# EAGLE design hd6303-mb-ram-rom-x1.3 (EAGLE 9.2.2)

## Sheet 1 of 2
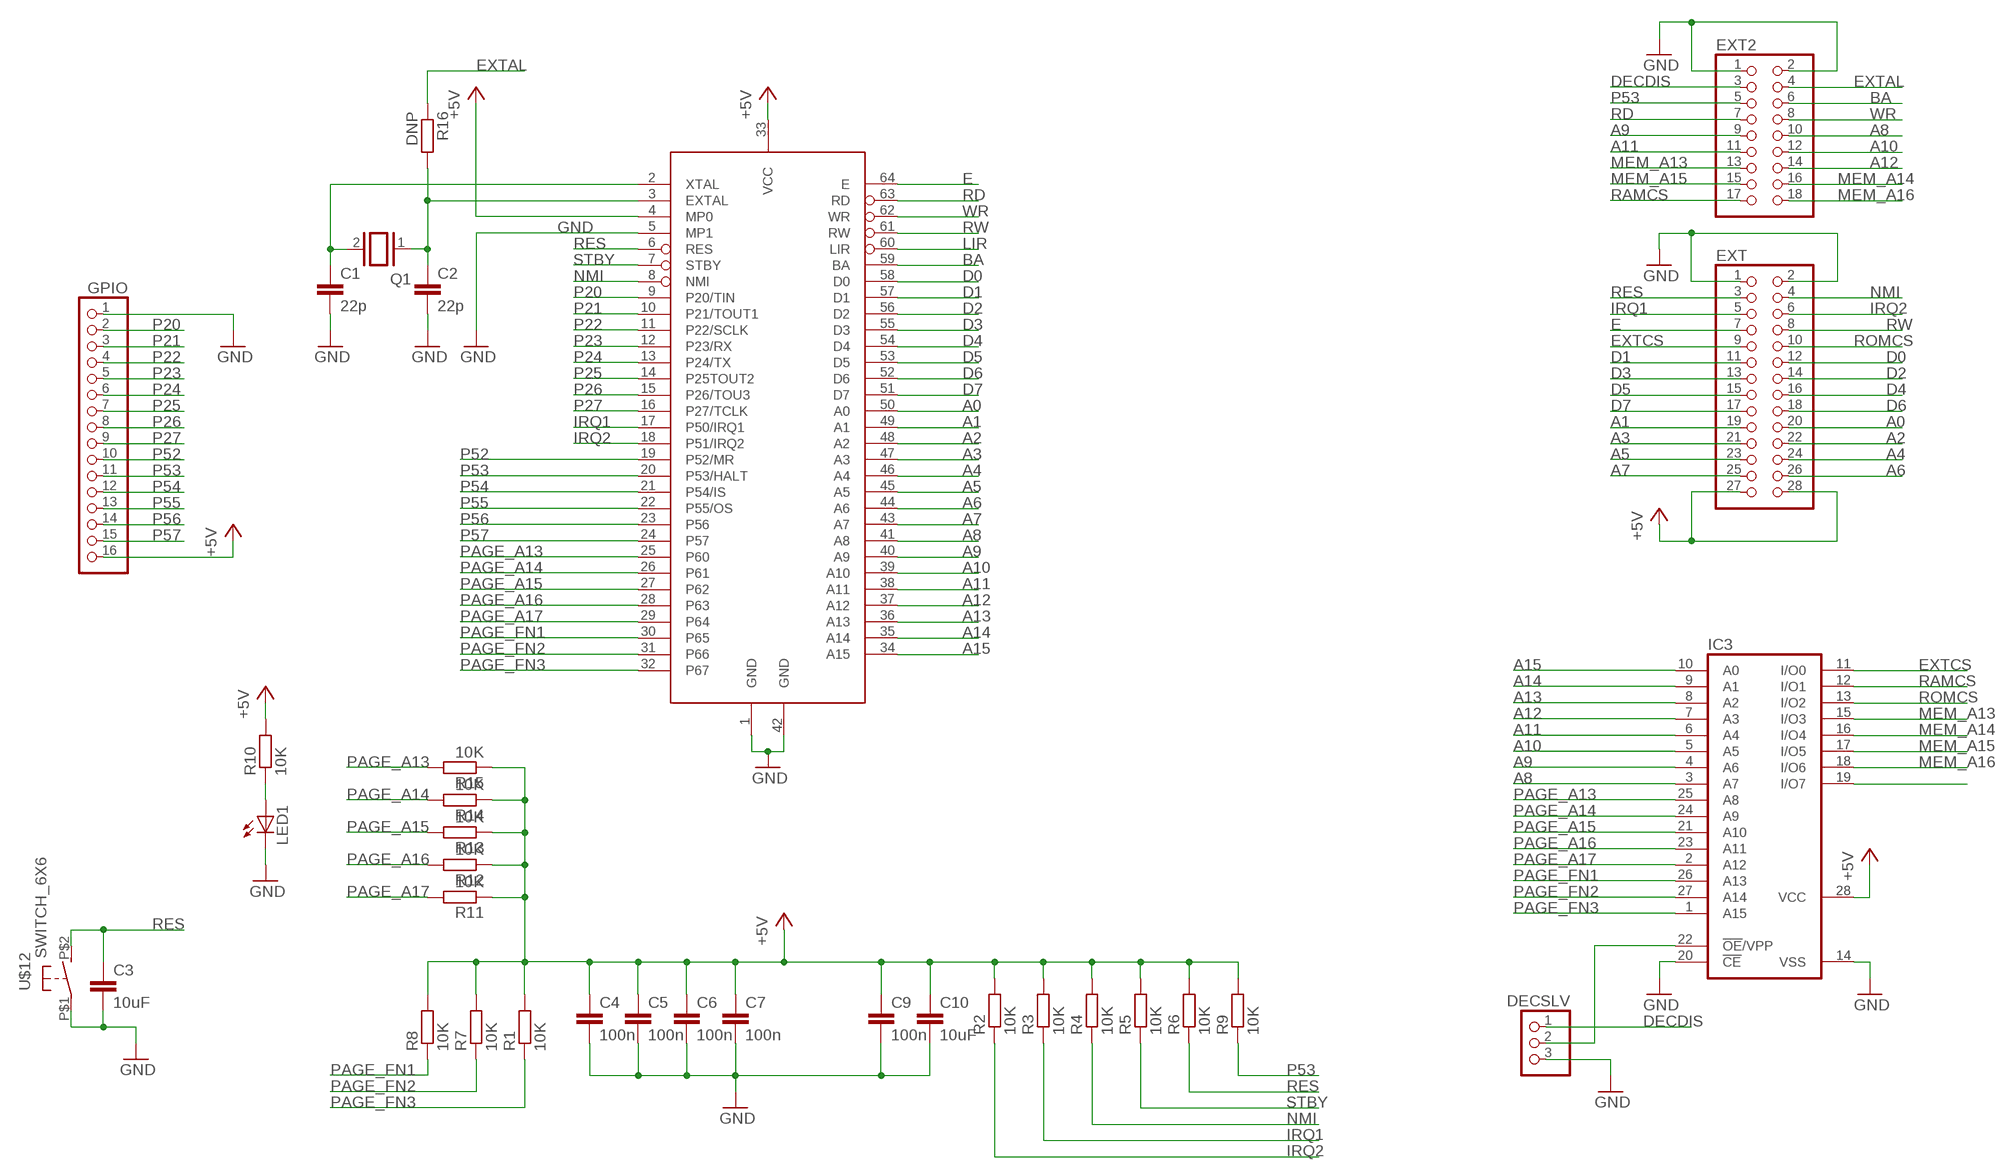
[diagram p0: schematic, sheet 1]

### Parts
C1  22p  C-EUC0603  [C0603]
C2  22p  C-EUC0603  [C0603]
C3  10uF  C-EUC0805  [C0805]
C4  100n  C-EUC0603  [C0603]
C5  100n  C-EUC0603  [C0603]
C6  100n  C-EUC0603  [C0603]
C7  100n  C-EUC0603  [C0603]
C9  100n  C-EUC0603  [C0603]
C10  10uF  C-EUC0805  [C0805]
DECSLV  PINHD-1X3  [1X03]
EXT  PINHD-2X14  [2X14]
EXT2  PINHD-2X9  [2X09]
GPIO  PINHD-1X16  [1X16]
IC3  27512G  [DIL28-6]
LED1  LED5MM  [LED5MM]
Q1  XTAL/S  [QS]
R1  10K  R-EU_R0603  [R0603]
R2  10K  R-EU_R0603  [R0603]
R3  10K  R-EU_R0603  [R0603]
R4  10K  R-EU_R0603  [R0603]
R5  10K  R-EU_R0603  [R0603]
R6  10K  R-EU_R0603  [R0603]
R7  10K  R-EU_R0603  [R0603]
R8  10K  R-EU_R0603  [R0603]
R9  10K  R-EU_R0603  [R0603]
R10  10K  R-EU_R0603  [R0603]
R11  10K  R-EU_R0603  [R0603]
R12  10K  R-EU_R0603  [R0603]
R13  10K  R-EU_R0603  [R0603]
R14  10K  R-EU_R0603  [R0603]
R15  10K  R-EU_R0603  [R0603]
R16  DNP  R-EU_R0603  [R0603]
U$1  HD6303YCP  [DP-64S]
U$12  SWITCH_6X6  [SWITCH_6X6]

### Nets
+5V [power]: C4.1 C5.1 C6.1 C7.1 C9.1 C10.1 EXT.27 EXT.28 GPIO.16 IC3.28(VCC) R1.2 R2.2 R3.2 R4.2 R5.2 R6.2 R7.2 R8.2 R9.2 R10.2 R11.1 R12.1 R13.1 R14.1 R15.1 U$1.4(MP0) U$1.33(VCC) ; also sheet 2
A0: EXT.20 U$1.50(A0) ; also sheet 2
A1: EXT.19 U$1.49(A1) ; also sheet 2
A2: EXT.22 U$1.48(A2) ; also sheet 2
A3: EXT.21 U$1.47(A3) ; also sheet 2
A4: EXT.24 U$1.46(A4) ; also sheet 2
A5: EXT.23 U$1.45(A5) ; also sheet 2
A6: EXT.26 U$1.44(A6) ; also sheet 2
A7: EXT.25 U$1.43(A7) ; also sheet 2
A8: EXT2.10 IC3.3(A7) U$1.41(A8) ; also sheet 2
A9: EXT2.9 IC3.4(A6) U$1.40(A9) ; also sheet 2
A10: EXT2.12 IC3.5(A5) U$1.39(A10) ; also sheet 2
A11: EXT2.11 IC3.6(A4) U$1.38(A11) ; also sheet 2
A12: EXT2.14 IC3.7(A3) U$1.37(A12) ; also sheet 2
A13: IC3.8(A2) U$1.36(A13)
A14: IC3.9(A1) U$1.35(A14)
A15: IC3.10(A0) U$1.34(A15)
BA: EXT2.6 U$1.59(BA)
D0: EXT.12 U$1.58(D0) ; also sheet 2
D1: EXT.11 U$1.57(D1) ; also sheet 2
D2: EXT.14 U$1.56(D2) ; also sheet 2
D3: EXT.13 U$1.55(D3) ; also sheet 2
D4: EXT.16 U$1.54(D4) ; also sheet 2
D5: EXT.15 U$1.53(D5) ; also sheet 2
D6: EXT.18 U$1.52(D6) ; also sheet 2
D7: EXT.17 U$1.51(D7) ; also sheet 2
DECDIS: DECSLV.1 EXT2.3
E: EXT.7 U$1.64(E)
EXTAL: EXT2.4 R16.1
EXTCS: EXT.9 IC3.11(I/O0)
GND [power]: C1.2 C2.2 C3.2 C4.2 C5.2 C6.2 C7.2 C9.2 C10.2 DECSLV.3 EXT2.1 EXT2.2 EXT.1 EXT.2 GPIO.1 IC3.14(VSS) IC3.20(!CE) LED1.K(C) U$1.1(GND) U$1.5(MP1) U$1.42(GND) U$12.P$1(P) ; also sheet 2
IRQ1: EXT.5 R3.1 U$1.17(P50/IRQ1)
IRQ2: EXT.6 R2.1 U$1.18(P51/IRQ2)
LIR: U$1.60(LIR)
MEM_A13: EXT2.13 IC3.15(I/O3) ; also sheet 2
MEM_A14: EXT2.16 IC3.16(I/O4) ; also sheet 2
MEM_A15: EXT2.15 IC3.17(I/O5) ; also sheet 2
MEM_A16: EXT2.18 IC3.18(I/O6) ; also sheet 2
N$1: LED1.A R10.1
N$2: DECSLV.2 IC3.22(!OE!/VPP)
N$5: C1.1 Q1.2 U$1.2(XTAL)
N$25: IC3.19(I/O7)
N$30: C2.1 Q1.1 R16.2 U$1.3(EXTAL)
NMI: EXT.4 R4.1 U$1.8(NMI)
P20: GPIO.2 U$1.9(P20/TIN)
P21: GPIO.3 U$1.10(P21/TOUT1)
P22: GPIO.4 U$1.11(P22/SCLK)
P23: GPIO.5 U$1.12(P23/RX)
P24: GPIO.6 U$1.13(P24/TX)
P25: GPIO.7 U$1.14(P25TOUT2)
P26: GPIO.8 U$1.15(P26/TOU3)
P27: GPIO.9 U$1.16(P27/TCLK)
P52: GPIO.10 U$1.19(P52/MR)
P53: EXT2.5 GPIO.11 R9.1 U$1.20(P53/HALT)
P54: GPIO.12 U$1.21(P54/IS)
P55: GPIO.13 U$1.22(P55/OS)
P56: GPIO.14 U$1.23(P56)
P57: GPIO.15 U$1.24(P57)
PAGE_A13: IC3.25(A8) R15.2 U$1.25(P60)
PAGE_A14: IC3.24(A9) R14.2 U$1.26(P61)
PAGE_A15: IC3.21(A10) R13.2 U$1.27(P62)
PAGE_A16: IC3.23(A11) R12.2 U$1.28(P63)
PAGE_A17: IC3.2(A12) R11.2 U$1.29(P64)
PAGE_FN1: IC3.26(A13) R8.1 U$1.30(P65)
PAGE_FN2: IC3.27(A14) R7.1 U$1.31(P66)
PAGE_FN3: IC3.1(A15) R1.1 U$1.32(P67)
RAMCS: EXT2.17 IC3.12(I/O1) ; also sheet 2
RD: EXT2.7 U$1.63(RD) ; also sheet 2
RES: C3.1 EXT.3 R6.1 U$1.6(RES) U$12.P$2(S)
ROMCS: EXT.10 IC3.13(I/O2) ; also sheet 2
RW: EXT.8 U$1.61(RW)
STBY: R5.1 U$1.7(STBY)
WR: EXT2.8 U$1.62(WR) ; also sheet 2

## Sheet 2 of 2
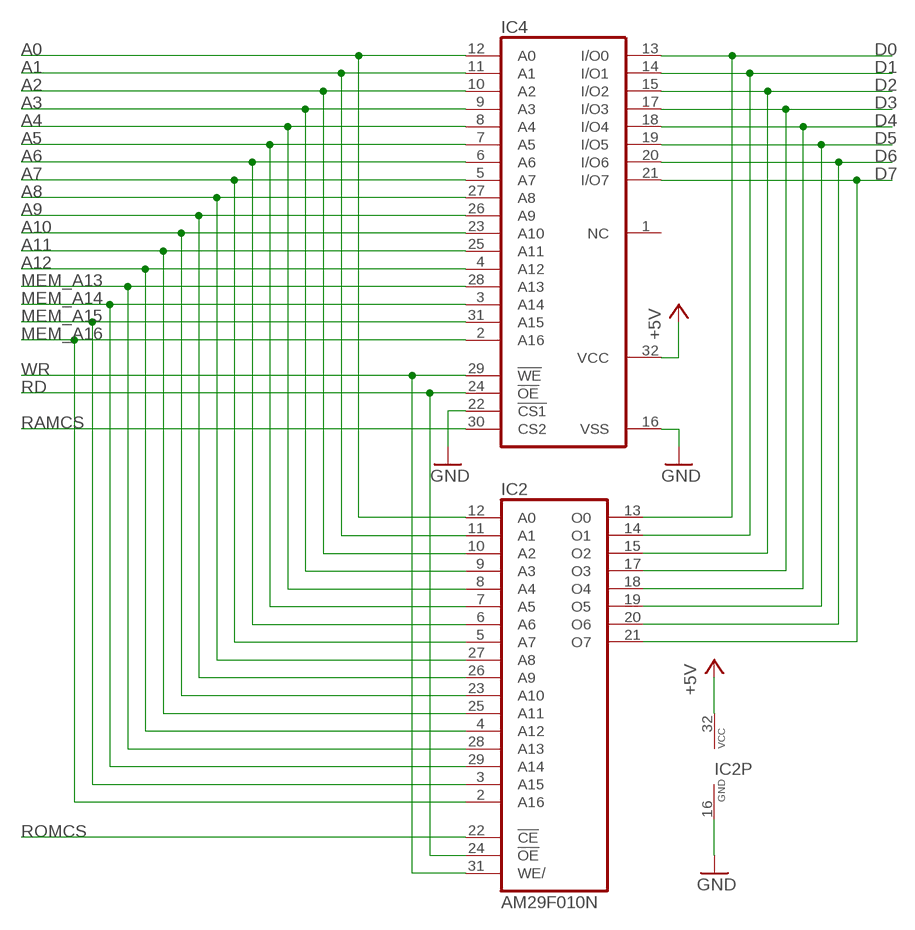
[diagram p1: schematic, sheet 2]

### Parts
IC2  AM29F010N  [DIP32]
IC4  628128P  [DIL32]

### Nets
+5V [power]: IC2.32(VCC) IC4.32(VCC) ; also sheet 1
A0: IC2.12(A0) IC4.12(A0) ; also sheet 1
A1: IC2.11(A1) IC4.11(A1) ; also sheet 1
A2: IC2.10(A2) IC4.10(A2) ; also sheet 1
A3: IC2.9(A3) IC4.9(A3) ; also sheet 1
A4: IC2.8(A4) IC4.8(A4) ; also sheet 1
A5: IC2.7(A5) IC4.7(A5) ; also sheet 1
A6: IC2.6(A6) IC4.6(A6) ; also sheet 1
A7: IC2.5(A7) IC4.5(A7) ; also sheet 1
A8: IC2.27(A8) IC4.27(A8) ; also sheet 1
A9: IC2.26(A9) IC4.26(A9) ; also sheet 1
A10: IC2.23(A10) IC4.23(A10) ; also sheet 1
A11: IC2.25(A11) IC4.25(A11) ; also sheet 1
A12: IC2.4(A12) IC4.4(A12) ; also sheet 1
D0: IC2.13(O0) IC4.13(I/O0) ; also sheet 1
D1: IC2.14(O1) IC4.14(I/O1) ; also sheet 1
D2: IC2.15(O2) IC4.15(I/O2) ; also sheet 1
D3: IC2.17(O3) IC4.17(I/O3) ; also sheet 1
D4: IC2.18(O4) IC4.18(I/O4) ; also sheet 1
D5: IC2.19(O5) IC4.19(I/O5) ; also sheet 1
D6: IC2.20(O6) IC4.20(I/O6) ; also sheet 1
D7: IC2.21(O7) IC4.21(I/O7) ; also sheet 1
GND [power]: IC2.16(GND) IC4.16(VSS) IC4.22(!CS1) ; also sheet 1
MEM_A13: IC2.28(A13) IC4.28(A13) ; also sheet 1
MEM_A14: IC2.29(A14) IC4.3(A14) ; also sheet 1
MEM_A15: IC2.3(A15) IC4.31(A15) ; also sheet 1
MEM_A16: IC2.2(A16) IC4.2(A16) ; also sheet 1
RAMCS: IC4.30(CS2) ; also sheet 1
RD: IC2.24(!OE) IC4.24(!OE) ; also sheet 1
ROMCS: IC2.22(!CE) ; also sheet 1
WR: IC2.31(WE/) IC4.29(!WE) ; also sheet 1
Unconnected: IC2.1(NC) IC2.30(NC) IC4.1(NC)

## Library data of the parts
C1 = rcl:C-EU: CAPACITOR, European symbol; SPICEPREFIX: C
C2 C4-C7 C9 = rcl:C-EU: CAPACITOR, European symbol
C3 C10 = resistor:C-EU: CAPACITOR, European symbol
DECSLV = pinhead:PINHD-1X3: PIN HEADER
EXT = pinhead:PINHD-2X14: PIN HEADER
EXT2 = pinhead:PINHD-2X9: PIN HEADER
GPIO = pinhead:PINHD-1X16: PIN HEADER
IC2 = am29-memory:AM29F010*: 1-Megabit FLASH MEMORY (128 K x 8 bit) 5 V-only
IC3 = memory-hitachi:27512G: MEMORY; OC_FARNELL: unknown; OC_NEWARK: unknown
IC4 = memory-hitachi:628128P: MEMORY; OC_FARNELL: unknown; OC_NEWARK: unknown
LED1 = led:LED: LED OSRAM: - CHIPLED LG R971, LG N971, LY N971, LG Q971, LY Q971, LO R971, LY R971 LH N974, LH R974 LS Q976, LO Q976, LY Q976 LO Q996 - Hyper CHIPLED LW Q18S LB Q993, LB Q99A, LB R99A - SideLED LS A670, LO A670, LY A670, LG A670, LP A670 LB A673, LV A673, LT A673, LW A673 LH A674 LY A675 LS A676, LA A676, LO A676, LY A676, LW A676 LS A679, LY A679, LG A679 - Hyper Micro SIDELED® LS Y876, LA Y876, LO Y876, LY Y876 LT Y87S - SmartLED LW L88C, LW L88S LB L89C, LB L89S, LG L890 LS L89K, LO L89K, LY L89K LS L896, LA L896, LO L896, LY L896 - TOPLED LS T670, LO T670, LY T670, LG T670, LP T670 LSG T670, LSP T670, LSY T670, LOP T670, LYG T670 LG T671, LOG T671, LSG T671 LB T673, LV T673, LT T673, LW T673 LH T674 LS T676, LA T676, LO T676, LY T676, LB T676, LH T676, LSB T676, LW T676 LB T67C, LV T67C, LT T67C, LS T67K, LO T67K, LY T67K, LW E67C LS E67B, LA E67B, LO E67B, LY E67B, LB E67C, LV E67C, LT E67C LW T67C LS T679, LY T679, LG T679 LS T770, LO T770, LY T770, LG T770, LP T770 LB T773, LV T773, LT T773, LW T773 LH T774 LS E675, LA E675, LY E675, LS T675 LS T776, LA T776, LO T776, LY T776, LB T776 LHGB T686 LT T68C, LB T68C - Hyper Mini TOPLED® LB M676 - Mini TOPLED Santana® LG M470 LS M47K, LO M47K, LY M47K Source: http://www.osram.convergy.de LUXEON: - LUMILED® LXK2-PW12-R00, LXK2-PW12-S00, LXK2-PW14-U00, LXK2-PW14-V00 LXK2-PM12-R00, LXK2-PM12-S00, LXK2-PM14-U00 LXK2-PE12-Q00, LXK2-PE12-R00, LXK2-PE12-S00, LXK2-PE14-T00, LXK2-PE14-U00 LXK2-PB12-K00, LXK2-PB12-L00, LXK2-PB12-M00, LXK2-PB14-N00, LXK2-PB14-P00, LXK2-PB14-Q00 LXK2-PR12-L00, LXK2-PR12-M00, LXK2-PR14-Q00, LXK2-PR14-R00 LXK2-PD12-Q00, LXK2-PD12-R00, LXK2-PD12-S00 LXK2-PH12-R00, LXK2-PH12-S00 LXK2-PL12-P00, LXK2-PL12-Q00, LXK2-PL12-R00 Source: www.luxeon.com KINGBRIGHT: KA-3528ASYC Source: www.kingbright.com
Q1 = special:XTAL/S: CRYSTAL
R1-R16 = resistor:R-EU_: RESISTOR, European symbol
U$1 = addons-lib:HD6303YCP
U$12 = mouse_enc:SWITCH_6X6

## Net classes
0 default: width 0.152 mm
1 power: width 0.813 mm

## Board
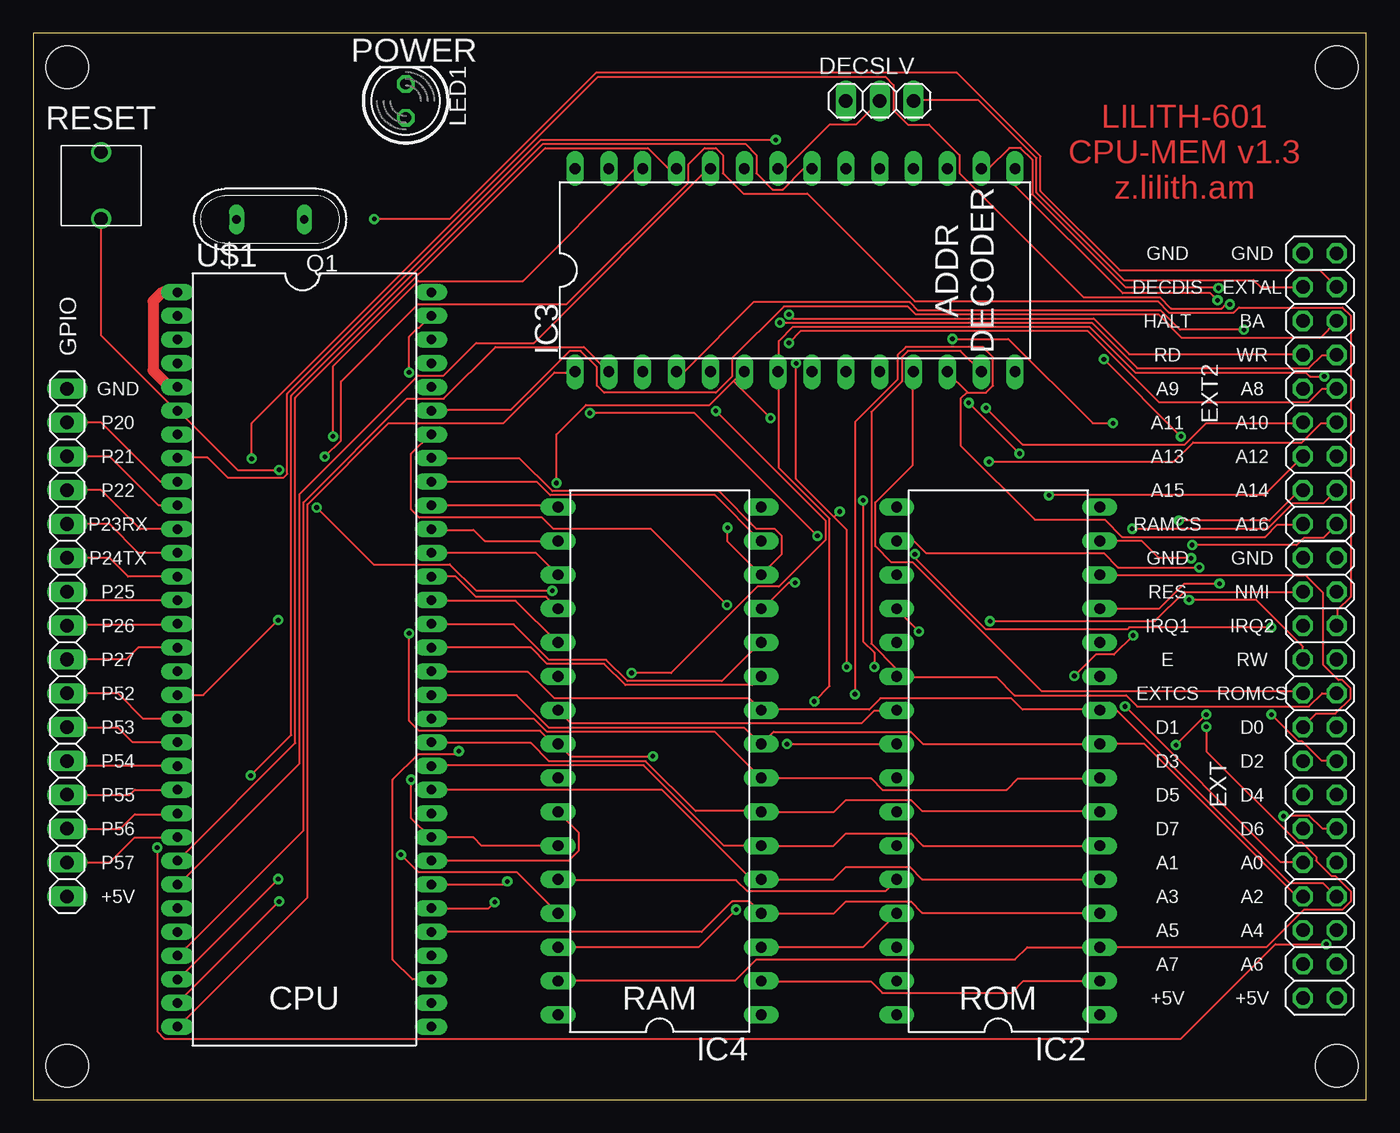
[diagram p2: board, top side]
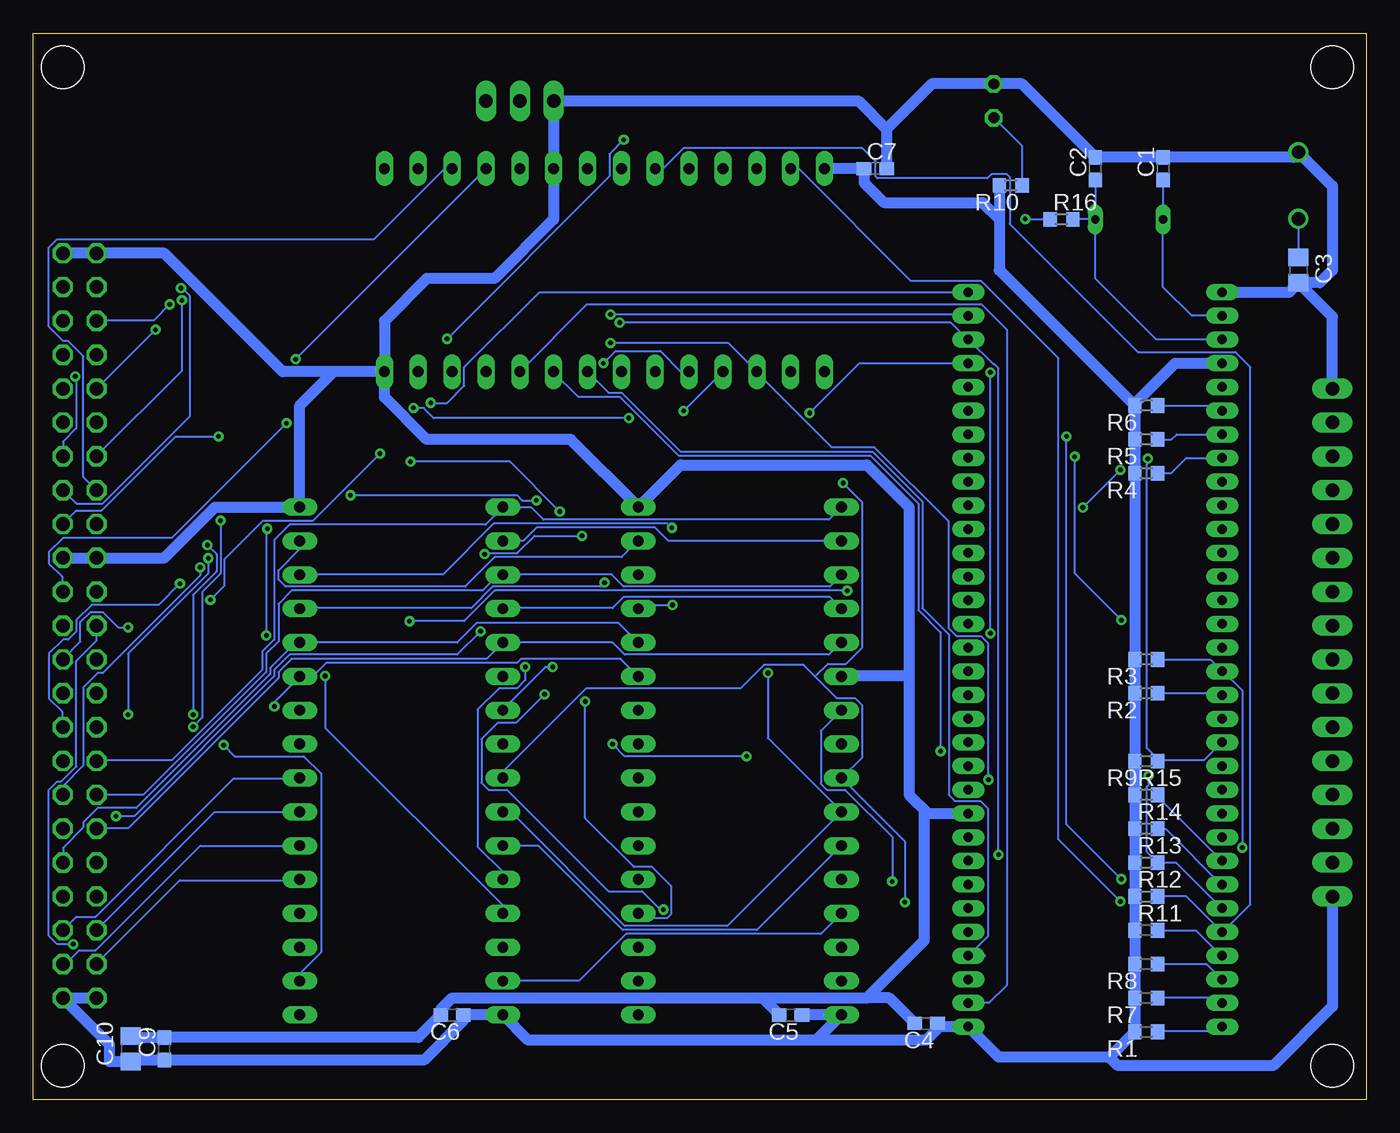
[diagram p3: board, bottom side, seen from below]

Size 100 x 80 mm. Coordinates in mm from the lower left corner, seen from the top.
Outline: 0,0 100,0 100,80 0,80 0,0
Copper layers (1*16): Top 0.035mm / dielectric 1.5mm / Bottom 0.035mm
Design rules "default *": minimum track width 6mil, minimum drill 0.35mm, track to track 6mil, track to pad 6mil, pad to pad 6mil, via to via 6mil, smd to smd 6mil, copper to edge 40mil, drill to drill 6mil, minimum pad ring 10mil, minimum via ring 8mil, stop-mask expansion 4mil, vias tented up to drill 23mil, thermal gap 10mil
Holes 3.2 mm at 2.54,77.47 2.54,2.54 97.79,2.54 97.79,77.47

### Footprints (pad centres in the part's own frame; a part is rotated, then mirrored left to right if it is on the bottom)
C0603 = smd 1.1 x 1: 1 -0.85,0; 2 0.85,0
C0805 = smd 1.3 x 1.5: 1 -0.95,0; 2 0.95,0
1X03 = drill 1.016 long: 1 -2.54,0; 2 0,0; 3 2.54,0
2X14 = drill 1.016 octagon: 1 -16.51,-1.27; 2 -16.51,1.27; 3 -13.97,-1.27; 4 -13.97,1.27; 5 -11.43,-1.27; 6 -11.43,1.27; 7 -8.89,-1.27; 8 -8.89,1.27; 9 -6.35,-1.27; 10 -6.35,1.27; 11 -3.81,-1.27; 12 -3.81,1.27; 13 -1.27,-1.27; 14 -1.27,1.27; 15 1.27,-1.27; 16 1.27,1.27; 17 3.81,-1.27; 18 3.81,1.27; 19 6.35,-1.27; 20 6.35,1.27; 21 8.89,-1.27; 22 8.89,1.27; 23 11.43,-1.27; 24 11.43,1.27; 25 13.97,-1.27; 26 13.97,1.27; 27 16.51,-1.27; 28 16.51,1.27
2X09 = drill 1.016 octagon: 1 -10.16,-1.27; 2 -10.16,1.27; 3 -7.62,-1.27; 4 -7.62,1.27; 5 -5.08,-1.27; 6 -5.08,1.27; 7 -2.54,-1.27; 8 -2.54,1.27; 9 0,-1.27; 10 0,1.27; 11 2.54,-1.27; 12 2.54,1.27; 13 5.08,-1.27; 14 5.08,1.27; 15 7.62,-1.27; 16 7.62,1.27; 17 10.16,-1.27; 18 10.16,1.27
1X16 = drill 1.016 long: 1 -19.05,0; 2 -16.51,0; 3 -13.97,0; 4 -11.43,0; 5 -8.89,0; 6 -6.35,0; 7 -3.81,0; 8 -1.27,0; 9 1.27,0; 10 3.81,0; 11 6.35,0; 12 8.89,0; 13 11.43,0; 14 13.97,0; 15 16.51,0; 16 19.05,0
DIP32 = drill 0.813 long: 1 -19.05,-7.62; 2 -16.51,-7.62; 3 -13.97,-7.62; 4 -11.43,-7.62; 5 -8.89,-7.62; 6 -6.35,-7.62; 7 -3.81,-7.62; 8 -1.27,-7.62; 9 1.27,-7.62; 10 3.81,-7.62; 11 6.35,-7.62; 12 8.89,-7.62; 13 11.43,-7.62; 14 13.97,-7.62; 15 16.51,-7.62; 16 19.05,-7.62; 17 19.05,7.62; 18 16.51,7.62; 19 13.97,7.62; 20 11.43,7.62; 21 8.89,7.62; 22 6.35,7.62; 23 3.81,7.62; 24 1.27,7.62; 25 -1.27,7.62; 26 -3.81,7.62; 27 -6.35,7.62; 28 -8.89,7.62; 29 -11.43,7.62; 30 -13.97,7.62; 31 -16.51,7.62; 32 -19.05,7.62
DIL28-6 = drill 0.813 long: 1 -16.51,-7.62; 2 -13.97,-7.62; 3 -11.43,-7.62; 4 -8.89,-7.62; 5 -6.35,-7.62; 6 -3.81,-7.62; 7 -1.27,-7.62; 8 1.27,-7.62; 9 3.81,-7.62; 10 6.35,-7.62; 11 8.89,-7.62; 12 11.43,-7.62; 13 13.97,-7.62; 14 16.51,-7.62; 15 16.51,7.62; 16 13.97,7.62; 17 11.43,7.62; 18 8.89,7.62; 19 6.35,7.62; 20 3.81,7.62; 21 1.27,7.62; 22 -1.27,7.62; 23 -3.81,7.62; 24 -6.35,7.62; 25 -8.89,7.62; 26 -11.43,7.62; 27 -13.97,7.62; 28 -16.51,7.62
DIL32 = drill 0.813 long: 1 -19.05,-7.62; 2 -16.51,-7.62; 3 -13.97,-7.62; 4 -11.43,-7.62; 5 -8.89,-7.62; 6 -6.35,-7.62; 7 -3.81,-7.62; 8 -1.27,-7.62; 9 1.27,-7.62; 10 3.81,-7.62; 11 6.35,-7.62; 12 8.89,-7.62; 13 11.43,-7.62; 14 13.97,-7.62; 15 16.51,-7.62; 16 19.05,-7.62; 17 19.05,7.62; 18 16.51,7.62; 19 13.97,7.62; 20 11.43,7.62; 21 8.89,7.62; 22 6.35,7.62; 23 3.81,7.62; 24 1.27,7.62; 25 -1.27,7.62; 26 -3.81,7.62; 27 -6.35,7.62; 28 -8.89,7.62; 29 -11.43,7.62; 30 -13.97,7.62; 31 -16.51,7.62; 32 -19.05,7.62
LED5MM = drill 0.813 octagon: A -1.27,0; K 1.27,0
QS = drill 0.61 long: 1 -2.54,0; 2 2.54,0
R0603 = smd 1 x 1.1: 1 -0.85,0; 2 0.85,0
DP-64S = drill 0.711 long: 1 -27.559,-9.525; 2 -25.781,-9.525; 3 -24.003,-9.525; 4 -22.225,-9.525; 5 -20.447,-9.525; 6 -18.669,-9.525; 7 -16.891,-9.525; 8 -15.113,-9.525; 9 -13.335,-9.525; 10 -11.557,-9.525; 11 -9.779,-9.525; 12 -8.001,-9.525; 13 -6.223,-9.525; 14 -4.445,-9.525; 15 -2.667,-9.525; 16 -0.889,-9.525; 17 0.889,-9.525; 18 2.667,-9.525; 19 4.445,-9.525; 20 6.223,-9.525; 21 8.001,-9.525; 22 9.779,-9.525; 23 11.557,-9.525; 24 13.335,-9.525; 25 15.113,-9.525; 26 16.891,-9.525; 27 18.669,-9.525; 28 20.447,-9.525; 29 22.225,-9.525; 30 24.003,-9.525; 31 25.781,-9.525; 32 27.559,-9.525; 33 27.559,9.525; 34 25.781,9.525; 35 24.003,9.525; 36 22.225,9.525; 37 20.447,9.525; 38 18.669,9.525; 39 16.891,9.525; 40 15.113,9.525; 41 13.335,9.525; 42 11.557,9.525; 43 9.779,9.525; 44 8.001,9.525; 45 6.223,9.525; 46 4.445,9.525; 47 2.667,9.525; 48 0.889,9.525; 49 -0.889,9.525; 50 -2.667,9.525; 51 -4.445,9.525; 52 -6.223,9.525; 53 -8.001,9.525; 54 -9.779,9.525; 55 -11.557,9.525; 56 -13.335,9.525; 57 -15.113,9.525; 58 -16.891,9.525; 59 -18.669,9.525; 60 -20.447,9.525; 61 -22.225,9.525; 62 -24.003,9.525; 63 -25.781,9.525; 64 -27.559,9.525
SWITCH_6X6 = drill 1: P$1 -2.5,0; P$2 2.5,0

### Placement (x,y rotation side)
C1  15.24,69.85 90 bottom
C2  20.32,69.85 90 bottom
C3  5.08,62.23 270 bottom
C4  33.02,5.71 180 bottom
C5  43.18,6.35 180 bottom
C6  68.58,6.35 180 bottom
C7  36.83,69.85 0 bottom
C9  90.17,3.81 90 bottom
C10  92.71,3.81 90 bottom
DECSLV  63.5,74.93 180 top
EXT  96.52,24.13 270 top
EXT2  96.52,53.34 270 top
GPIO  2.54,34.29 270 top
IC2  72.39,25.4 90 top
IC3  57.15,62.23 0 top
IC4  46.99,25.4 90 top
LED1  27.94,74.93 90 top
Q1  17.78,66.04 180 top
R1  16.51,5.08 180 bottom
R2  16.51,30.48 180 bottom
R3  16.51,33.02 180 bottom
R4  16.51,46.99 180 bottom
R5  16.51,49.53 180 bottom
R6  16.51,52.07 180 bottom
R7  16.51,7.62 180 bottom
R8  16.51,10.16 180 bottom
R9  16.51,25.4 180 bottom
R10  26.67,68.58 180 bottom
R11  16.51,12.7 0 bottom
R12  16.51,15.24 0 bottom
R13  16.51,17.78 0 bottom
R14  16.51,20.32 0 bottom
R15  16.51,22.86 0 bottom
R16  22.86,66.04 0 bottom
U$1  20.32,33.02 270 top
U$12  5.08,68.58 270 top

### Tracks (layer width: path | path; a pad name or v marks a point on that pad's centre or on a via)
+5V
  Bottom 0.813: IC3.28 C7.1 37.68,68.8 36.2,67.31 28.79,67.31 27.52,66.04 | R10.2 27.52,66.04 | 27.52,66.04 27.52,62.23 R6.2 | R6.2 R5.2 R4.2 R3.2 R2.2 R9.2 R15.1 R14.1 R13.1 R12.1 R11.1 R8.2 R7.2 R1.2 19.27,3.17 | C5.1 IC4.32 41.27,4.45 | 41.27,4.45 62.87,4.45 IC2.32 C6.1 67.73,5.93 70.7,2.96 C9.1 92.61,2.96 C10.1 94.3,2.86 94.3,4.13 EXT.28 EXT.27 | GPIO.16 2.54,6.99 6.99,2.54 18.63,2.54 19.27,3.17 | 19.27,3.17 27.56,3.17 U$1.33 31.92,5.46 C4.1 32.17,5.29 33.02,4.45 41.27,4.45 | U$1.4 14.33,55.24 17.14,52.43 R6.2
A0
  Top 0.152: U$1.50 29.87,35.66 36.04,35.66 38.71,32.99 42.98,32.99 44.58,31.39 51.66,31.39 54.56,34.29 IC4.12
  Bottom 0.152: IC4.12 54.63,34.29 56.08,35.74 66.75,35.74 68.2,34.29 IC2.12 80.31,34.29 82.22,32.38 82.22,31.93 92.28,21.87 95.17,21.87 96.24,20.8 96.24,20.42 97.77,18.9 97.77,17.83 EXT.20
A1  (via drill 0.35)
  Top 0.152: U$1.49 37.34,33.91 38.56,32.69 42.82,32.69 44.42,31.09 53.95,31.09 IC4.11 | v81.92,29.49 93.57,17.83 95.25,17.83 EXT.19
  Bottom 0.152: IC4.11 55.93,33.07 63.4,33.07 63.7,32.77 78.03,32.77 79.02,31.77 80.01,31.77 IC2.11 80.01,31.7 81.92,29.79 v81.92,29.49
A2
  Top 0.152: U$1.48 29.87,32.08 37.11,32.08 39.09,30.1 53.72,30.1 IC4.10 54.63,29.26 62.71,29.26 63.55,30.1 73.38,30.1 74.22,29.26 80.01,29.26 IC2.10 80.01,29.18 81.31,29.18 94.26,16.23 96.77,16.23 97.77,15.24 EXT.22
A3
  Top 0.152: EXT.21 94.79,15.24 83.36,26.67 IC2.9 66.75,26.67 65.84,27.58 55.55,27.58 54.63,26.67 IC4.9 54.56,26.67 53.34,27.89 38.71,27.89 36.27,30.33 29.87,30.33 U$1.47
A4
  Top 0.152: U$1.46 37.57,28.57 38.56,27.58 51.13,27.58 54.56,24.16 IC4.8 54.63,24.08 62.87,24.08 63.7,23.24 73.03,23.24 73.86,24.08 80.01,24.08 IC2.8
  Bottom 0.152: EXT.24 96.77,13.72 95.33,13.72 84.96,24.08 80.01,24.08 IC2.8
A5
  Top 0.152: U$1.45 29.87,26.75 37.34,26.75 38.71,25.38 45.95,25.38 49.68,21.64 54.56,21.64 IC4.7 60.07,21.59 60.96,22.48 65.84,22.48 66.67,21.64 80.01,21.64 IC2.7
  Bottom 0.152: IC2.7 80.01,21.57 86.41,21.57 95.25,12.72 EXT.23
A6
  Top 0.152: U$1.44 29.87,25.07 45.8,25.07 51.82,19.05 IC4.6 60.05,19.05 60.96,19.96 65.84,19.96 66.75,19.05 IC2.6
  Bottom 0.152: IC2.6 87.48,19.05 95.33,11.2 96.55,11.2 97.54,10.21 97.77,10.21 EXT.26
A7
  Top 0.152: U$1.43 47.17,23.24 53.87,16.54 54.56,16.54 IC4.5 60.02,16.51 60.96,17.45 65.76,17.45 66.67,16.54 80.01,16.54 IC2.5
  Bottom 0.152: IC2.5 80.01,16.46 89,16.46 95.25,10.21 EXT.25
A8  (via drill 0.35)
  Top 0.152: v28.35,24 28.35,21.11 29.79,19.66 U$1.41 29.87,19.66 33.02,19.66 33.63,19.05 IC4.27 | EXT2.10 96.7,53.34 95.71,52.35 84.43,52.35 79.1,57.68 57.61,57.68 v56.69,56.77
  Bottom 0.152: v28.35,24 28.35,34.21 28.88,34.75 30.71,34.75 31.32,35.36 31.32,43.36 36.88,48.92 40.08,48.92 45.72,54.56 IC3.3 45.72,54.63 47.85,56.77 v56.69,56.77 | IC2.27 62.1,19.05 55.78,12.72 45.72,12.72 39.4,19.05 IC4.27
A9  (via drill 0.35)
  Top 0.152: U$1.40 40.16,17.91 40.92,18.67 40.92,20.04 IC4.26 | v90.83,57.76 86.03,57.76 84.58,59.21 66.37,59.21 65.76,59.82 54.03,59.82 48.84,54.63 48.31,54.63 IC3.4 | v44.88,32 47.85,32 54.33,38.48 55.93,38.48 59.44,41.99 59.44,43.43 v51.21,51.66
  Bottom 0.152: IC2.26 64.77,21.57 64.16,21.57 55.63,13.03 47.93,13.03 IC4.26 39.4,21.64 44.88,27.13 v44.88,32 | EXT2.9 v90.83,57.76 | IC3.4 v51.21,51.66
A10  (via drill 0.35)
  Top 0.152: IC4.23 40.31,28.27 62.18,28.27 63.09,29.18 64.77,29.18 IC2.23 | v57.23,55.24 57.23,46.56 60.08,43.7 | 60.08,43.7 61.04,42.75 v61.04,32.46 | v71.7,47.85 85.57,47.85 87.02,49.3 95.17,49.3 96.62,50.75 97.77,50.75 EXT2.12 | 60.08,43.7 v60.5,44.12 | U$1.39 35.33,16.13 v35.56,16.36
  Bottom 0.152: v35.56,16.36 35.56,19.71 39.09,23.24 40.46,23.24 40.92,23.7 40.92,27.66 IC4.23 | v57.23,55.24 56.31,56.16 52.96,56.16 51.44,54.63 50.83,54.63 IC3.5 | v61.04,32.46 61.57,32.46 64.77,29.26 IC2.23 | v71.7,47.85 64.24,47.85 v60.5,44.12
A11  (via drill 0.35)
  Top 0.152: 52.54,53.91 50.75,52.12 41.45,52.12 39.24,49.91 v39.24,46.25 | 52.54,53.91 53.19,54.56 53.34,54.56 IC3.6 | v71.48,51.89 74.22,49.15 86.41,49.15 88.01,50.75 95.25,50.75 EXT2.11 | 52.54,53.91 v55.32,51.13 | U$1.38 34.16,14.35 v34.62,14.81
  Bottom 0.152: IC2.25 64.77,24.61 58.52,30.86 46.94,30.86 45.19,32.61 42.22,32.61 41.34,31.74 | 41.34,31.74 39.7,30.1 38.33,30.1 37.8,29.57 37.8,25.68 39.32,24.16 IC4.25 34.62,19.38 v34.62,14.81 | v39.24,46.25 37.8,44.81 37.8,33.91 39.01,32.69 40.39,32.69 41.34,31.74 | v71.48,51.89 70.71,51.89 69.95,51.13 v55.32,51.13
A12  (via drill 0.35)
  Top 0.152: U$1.37 50.14,12.57 52.43,14.86 53.72,14.86 IC4.4 60.07,13.97 60.96,14.86 65.84,14.86 66.67,14.02 80.01,14.02 IC2.4 | v58.6,29.87 59.74,31.01 59.74,43.59 55.93,47.4 55.93,54.56 IC3.7 55.93,54.63 55.93,56.92 57,57.99 79.25,57.99 82.68,54.56 95.48,54.56 95.78,54.25 v96.85,54.25
  Bottom 0.152: v58.6,29.87 58.6,21.11 54.94,17.45 53.57,17.45 52.12,16 52.12,13.95 52.43,13.64 54.25,13.64 54.56,13.95 IC4.4 | v96.85,54.25 96.77,54.18 96.77,50.37 97.77,49.38 97.77,48.31 EXT2.14
A13
  Bottom 0.152: IC3.8 56.84,53.03 55.85,53.03 51.44,48.62 37.03,48.62 33.3,44.88 33.3,36.88 31.32,34.9 31.32,22.86 30.86,22.4 28.96,22.4 28.35,21.79 28.35,12.27 29.79,10.82 U$1.36 28.57,10.79
A14  (via drill 0.35)
  Top 0.152: v31.93,26.14 31.7,25.91 28.88,25.91 26.98,24 26.98,10.49 28.45,9.02 U$1.35
  Bottom 0.152: v31.93,26.14 31.93,35.05 33.6,36.73 33.6,44.73 37.19,48.31 51.59,48.31 56.01,52.73 59.13,52.73 60.96,54.56 IC3.9
A15
  Bottom 0.152: IC3.10 58.45,59.66 28.88,59.66 26.98,57.76 26.98,8.59 28.32,7.24 U$1.34
BA
  Top 0.152: U$1.59 29.87,51.74 35.81,51.74 40.23,56.16 41.07,56.16 42.29,54.94 42.29,53.57 42.82,53.03 51.21,53.03 52.43,54.25 52.43,55.63 56.31,59.51 65.61,59.51 66.22,58.9 84.43,58.9 86.18,57.15 96.55,57.15 97.77,58.37 EXT2.6
D0  (via drill 0.35)
  Top 0.152: v52.05,37.11 46.33,42.82 39.01,42.82 38.18,43.66 28.96,43.66 28.35,44.27 28.35,48.46 29.79,49.91 U$1.58 | v57.15,38.79 56.69,38.79 54.79,36.88 54.63,36.88 IC4.13 | v89,38.71 86.36,38.71 84.48,36.83 IC2.13
  Bottom 0.152: v52.05,37.11 54.33,37.11 IC4.13 | v57.15,38.79 57.45,38.48 65.53,38.48 67.13,36.88 80.01,36.88 IC2.13 | v89,38.71 90.6,37.11 95.63,37.11 96.77,35.97 96.77,35.13 97.38,34.52 97.77,34.52 98.83,33.45 98.83,30.1 97.84,29.11 97.84,27.96 EXT.12
D1  (via drill 0.35)
  Top 0.152: IC2.14 80.01,39.32 95.48,39.32 96.77,38.02 96.77,32.61 97.92,31.47 98.22,31.47 98.83,30.86 98.83,30.1 97.69,28.96 96.24,28.96 95.25,27.96 EXT.11 | U$1.57 29.87,48.08 36.5,48.08 38.94,45.64 51.44,45.64 54.25,42.82 55.63,42.82 56.16,42.29 56.16,40.92 IC4.14 54.56,39.4 52.09,41.86 v52.09,42.9
  Bottom 0.152: v52.09,42.9 52.4,43.2 65.46,43.2 69.27,39.4 80.01,39.4 IC2.14
D2  (via drill 0.35)
  Top 0.152: U$1.56 29.87,46.33 37.8,46.33 38.79,45.34 51.13,45.34 54.56,41.91 IC4.15 | v92.89,28.88 94.87,26.9 95.17,26.9 96.62,25.45 97.77,25.45 EXT.14 | v86.87,40.62 84.45,40.62 83.16,41.91 IC2.15
  Bottom 0.152: IC2.15 80.01,41.3 81.61,39.7 81.61,39.01 81.08,38.48 67.59,38.48 65.38,40.69 55.85,40.69 54.63,41.91 IC4.15 | v92.89,28.88 92.89,33.45 86.87,39.47 v86.87,40.62
D3
  Top 0.152: U$1.55 31.75,44.58 39.24,44.58 IC4.17
  Bottom 0.152: 64.77,44.42 62.64,44.42 61.72,43.51 40.31,43.51 IC4.17 | 64.77,44.42 66.06,43.13 80.77,43.13 81.92,41.99 81.92,34.52 82.83,33.6 82.83,32.23 89.61,25.45 95.25,25.45 EXT.13 | 64.77,44.42 IC2.17
D4  (via drill 0.35)
  Top 0.152: U$1.54 29.87,42.75 33.02,42.75 33.86,41.91 IC4.18 | v87.48,39.93 81.38,39.93 80.31,41 66.98,41 66.06,41.91 IC2.18
  Bottom 0.152: IC2.18 63.25,41.91 62.26,42.9 53.34,42.9 52.35,41.91 IC4.18 | v87.48,39.93 87.48,39.32 94.79,32 95.17,32 96.24,30.94 96.24,25.07 97.77,23.55 97.77,22.86 EXT.16
D5
  Top 0.152: U$1.53 29.87,41 37.72,41 39.32,39.4 IC4.19
  Bottom 0.152: IC4.19 39.4,39.32 40.23,38.48 55.7,38.48 56.62,39.4 64.77,39.4 IC2.19 64.77,39.32 65.15,39.32 66.29,38.18 80.62,38.18 81.61,37.19 81.61,34.37 82.53,33.45 82.53,32.08 91.75,22.86 EXT.15
D6  (via drill 0.35)
  Top 0.152: U$1.52 31.7,39.24 33.22,37.72 38.48,37.72 IC4.20 | v93.8,21.26 93.88,21.34 95.71,21.34 96.7,20.34 97.77,20.34 EXT.18 | v66.45,35.13 64.77,36.8 IC2.20
  Bottom 0.152: IC2.20 64.77,36.88 56.54,36.88 55.7,37.72 40.23,37.72 39.4,36.88 IC4.20 | v93.8,21.26 92.43,21.26 81.92,31.77 81.92,32.23 80.77,33.38 68.2,33.38 v66.45,35.13
D7
  Top 0.152: U$1.51 29.87,37.41 36.2,37.41 39.32,34.29 IC4.21
  Bottom 0.152: IC4.21 39.4,34.29 40.31,33.38 55.63,33.38 56.54,34.29 IC2.21 65.99,33.07 80.62,33.07 81.61,32.08 81.61,31.62 92.89,20.34 95.25,20.34 EXT.17
DECDIS
  Top 0.152: DECSLV.1 66.06,74.98 70.92,74.98 75.26,70.64 75.26,68.05 81.81,61.49 91.54,61.49 92.08,60.96 EXT2.3
E  (via drill 0.35)
  Top 0.152: v73.99,48.46 v70.18,52.27 | v86.72,37.49 91.75,37.49 95.25,33.98 EXT.7
  Bottom 0.152: U$1.64 62.03,60.58 67.67,54.94 67.67,53.57 68.96,52.27 v70.18,52.27 | v73.99,48.46 79.02,43.43 82.75,43.43 85.65,40.54 85.65,38.56 v86.72,37.49
EXTAL  (via drill 0.35)
  Top 0.152: v25.58,66.06 31.24,66.06 42.22,77.04 69.29,77.04 75.56,70.76 75.56,68.17 81.51,62.23 96.52,62.23 EXT2.4
  Bottom 0.152: v25.58,66.06 23.77,66.06 R16.1
EXTCS
  Top 0.152: EXT.9 95.1,30.63 75.67,30.63 65.99,40.31 64.39,40.31 63.17,41.53 63.17,44.81 65.99,47.62 65.99,54.56 IC3.11
GND
  Top 0.813: U$1.1 9.68,60.58 8.99,59.89 8.99,54.71 10.21,53.49 10.74,53.49 U$1.5
  Bottom 0.813: IC3.14 73.66,58.42 70.48,61.59 65.41,61.59 60.96,66.04 IC3.20 DECSLV.3 38.1,74.93 35.98,72.81 | IC3.14 77.47,54.61 | 77.47,54.61 81.28,54.61 90.17,63.5 EXT2.1 EXT2.2 | 77.47,54.61 80.01,52.07 IC2.16 86.36,44.45 90.17,40.64 EXT.1 EXT.2 | IC3.14 73.66,52.7 70.48,49.53 59.69,49.53 IC4.16 51.44,47.62 37.47,47.62 34.29,44.45 34.29,31.77 | 35.98,72.81 C7.2 | 35.98,72.81 32.59,76.2 LED1.K 25.82,76.2 C2.2 C1.2 5.46,70.7 U$12.P$1 2.54,68.54 2.54,62.23 3.49,61.28 C3.2 | U$1.1 5.78,60.58 C3.2 | GPIO.1 2.54,58.74 C3.2 | C10.2 92.61,4.66 C9.2 71.12,4.66 C6.2 69.43,6.77 68.58,7.62 45.3,7.62 | 45.3,7.62 C5.2 | 45.3,7.62 37.47,7.62 | 37.47,7.62 33.15,11.94 33.15,21.46 32.89,21.46 | 32.89,21.46 U$1.42 | C4.2 35.77,7.62 37.47,7.62 | 34.29,31.77 34.29,22.86 32.89,21.46 | 34.29,31.77 39.32,31.77 IC4.22
IRQ1  (via drill 0.35)
  Top 0.152: v97,11.66 93.19,11.66 86.11,4.57 9.83,4.57 9.3,5.11 v9.3,18.9
  Bottom 0.152: R3.1 15.62,32.99 11.66,32.99 U$1.17 10.74,32.16 9.3,30.71 v9.3,18.9 | EXT.5 95.25,34.44 96.77,32.92 96.77,24.99 97.92,23.85 98.22,23.85 98.83,23.24 98.83,12.27 98.22,11.66 v97,11.66
IRQ2  (via drill 0.35)
  Top 0.152: v21.87,48.23 23.09,49.45 23.09,53.87 28.88,59.66 40.01,59.66 49.15,68.81 49.15,70.18 50.37,71.4 51.21,71.4 51.74,70.87 51.74,69.49 53.26,67.97 58.06,67.97 66.14,59.89 84.35,59.89 85.19,59.05 90.07,59.05 90.45,59.44 98.22,59.44 98.83,58.83 98.83,37.72 97.84,36.73 97.84,35.59 EXT.6 | U$1.18 12.75,30.35 v18.36,35.97
  Bottom 0.152: R2.1 10.9,30.48 10.82,30.4 U$1.18 | v21.87,48.23 21.87,39.47 v18.36,35.97
MEM_A13  (via drill 0.35)
  Top 0.152: IC4.28 39.4,16.46 52.73,16.46 53.57,15.62 63.93,15.62 64.77,16.46 IC2.28 | v88.85,59.97 88.32,60.5 81.74,60.5 73.66,68.58 73.69,68.61 73.69,69.8 IC3.15 | v63.09,32.46 63.09,33.53 62.26,34.37 v62.26,44.96 | v76.2,45.34 92.35,45.34 95.25,48.23 EXT2.13
  Bottom 0.152: v88.85,59.97 88.85,54.71 95.25,48.31 EXT2.13 | IC2.28 64.77,17.07 66.67,18.97 66.67,29.26 65.08,30.86 63.7,30.86 63.09,31.47 v63.09,32.46 | v62.26,44.96 63.32,44.96 63.7,45.34 v76.2,45.34
MEM_A14  (via drill 0.35)
  Top 0.152: IC4.3 62.26,11.43 64.77,13.95 IC2.29 | IC3.16 71.17,69.88 71.7,69.88 73.23,71.4 74.07,71.4 74.95,70.51 74.95,67.92 81.92,60.96 88.85,60.96 v88.92,60.88 | v78.11,31.77 79.7,33.38 81.08,33.38 v82.53,34.82 | v82.45,42.82 92.58,42.82 94.49,44.73 96.77,44.73 97.77,45.72 EXT2.16
  Bottom 0.152: EXT2.16 97.77,45.72 96.77,44.73 94.79,44.73 88.24,51.28 88.24,60.27 88.85,60.88 v88.92,60.88 | IC2.29 64.77,14.55 78.11,27.89 v78.11,31.77 | v82.53,34.82 82.53,42.75 v82.45,42.82
MEM_A15  (via drill 0.35)
  Top 0.152: IC4.31 39.4,8.91 52.65,8.91 54.25,10.52 73.66,10.52 74.57,11.43 IC2.3 92.51,11.43 95.33,14.25 98.22,14.25 98.83,14.86 98.83,15.62 97.69,16.76 97.38,16.76 96.24,17.91 96.24,18.21 95.17,19.28 94.87,19.28 88.01,26.14 v88.01,27.96 | v85.95,43.43 92.73,43.43 95.02,45.72 EXT2.15
  Bottom 0.152: EXT2.15 96.24,46.71 96.24,55.78 97.38,56.92 97.77,56.92 98.83,57.99 98.83,63.93 98.22,64.54 74.45,64.54 69.19,69.8 68.58,69.8 IC3.17 | v88.01,27.96 87.33,28.65 87.33,38.1 85.95,39.47 v85.95,43.43
MEM_A16  (via drill 0.35)
  Top 0.152: IC4.2 54.63,8.84 62.87,8.84 63.7,8 73.41,8 74.3,8.89 79.96,8.89 80.01,8.84 IC2.2 | v86.11,49.76 v80.31,55.55 | v88.01,28.88 v85.72,26.59 | v86.94,41.6 94.79,41.6 95.33,42.14 96.77,42.14 97.77,43.13 EXT2.18
  Bottom 0.152: v80.31,55.55 66.06,69.8 IC3.18 | v86.11,49.76 89.31,49.76 94.87,44.2 96.77,44.2 EXT2.18 | IC2.2 80.01,9.45 78.41,11.05 78.41,24.46 79.7,25.76 84.89,25.76 v85.72,26.59 | v88.01,28.88 88.01,37.87 86.26,39.62 86.26,40.92 v86.94,41.6
N$1
  Bottom 0.152: LED1.A 25.83,71.55 25.83,68.58 R10.1
N$2
  Top 0.152: DECSLV.2 61.72,73.15 59.74,73.15 56.46,69.88 55.93,69.88 IC3.22
N$5
  Bottom 0.152: U$1.2 13.08,58.8 15.24,60.96 Q1.2 C1.1
N$30
  Bottom 0.152: C2.1 Q1.1 | U$1.3 15.75,57.02 20.32,61.59 Q1.1 | Q1.1 R16.2
NMI  (via drill 0.35)
  Top 0.152: v81,50.75 79.48,50.75 73.15,57.07 v68.96,57.07 | v55.7,72.01 38.1,72.01 19.05,52.96 19.05,46.94 18.75,46.63 14.61,46.63 13.08,48.16 10.82,48.16 U$1.8
  Bottom 0.152: R4.1 15.62,47.02 14.61,47.02 13.49,48.13 U$1.8 | v81,50.75 89.61,42.14 97.77,42.14 98.83,41.07 98.83,40.23 97.84,39.24 97.84,38.1 EXT.4 | v68.96,57.07 56.77,69.27 56.77,70.94 v55.7,72.01
P20
  Top 0.152: U$1.9 9.53,46.35 5.08,50.8 GPIO.2
P21
  Top 0.152: U$1.10 9.4,44.58 5.71,48.26 GPIO.3
P22
  Top 0.152: U$1.11 8,42.8 5.08,45.72 GPIO.4
P23
  Top 0.152: U$1.12 7.87,41.02 5.71,43.18 GPIO.5
P24
  Top 0.152: U$1.13 7.11,39.24 5.71,40.64 GPIO.6
P25
  Top 0.152: U$1.14 10.74,37.49 3.2,37.49 2.59,38.1 GPIO.7
P26
  Top 0.152: U$1.15 10.74,35.66 2.67,35.66 2.59,35.59 GPIO.8
P27
  Top 0.152: U$1.16 7.87,33.91 6.99,33.02 GPIO.9
P52
  Top 0.152: U$1.19 8.26,28.57 6.35,30.48 GPIO.10
P53  (via drill 0.35)
  Top 0.152: GPIO.11 2.59,27.89 6.35,27.89 7.44,26.8 U$1.20 | v89.76,59.66 89.46,59.66 89.15,59.36 85.34,59.36 84.51,60.2 78.79,60.2 69.49,69.49 69.49,70.87 67.21,73.15 65.61,73.15 64.54,74.22 64.54,76.12 63.93,76.73 42.37,76.73 16.38,50.75 v16.38,48.08
  Bottom 0.152: U$1.20 10.82,26.82 12.19,25.45 15.62,25.45 R9.1 15.62,25.53 16.46,26.36 16.46,47.62 16.38,47.7 v16.38,48.08 | v89.76,59.66 90.98,58.45 95.25,58.45 EXT2.5
P54
  Top 0.152: U$1.21 10.74,25.07 2.9,25.07 2.59,25.38 GPIO.12
P55
  Top 0.152: U$1.22 7.62,23.24 7.24,22.86 GPIO.13
P56
  Top 0.152: U$1.23 10.74,21.41 7.62,21.41 6.53,20.32 GPIO.14
P57
  Top 0.152: U$1.24 10.74,19.66 7.62,19.66 5.74,17.78 GPIO.15
PAGE_A13
  Top 0.152: IC3.25 48.23,69.88 47.62,69.88 46.1,71.4 38.41,71.4 19.66,52.65 19.66,26.75 10.82,17.91 U$1.25
  Bottom 0.152: R15.2 15.62,22.86 15.62,22.71 10.82,17.91 U$1.25
PAGE_A14
  Top 0.152: IC3.24 50.75,69.8 50.6,69.8 37.57,56.77 33.22,56.77 30.79,54.33 28.88,54.33 19.96,45.41 19.96,25.22 10.82,16.08 U$1.26
  Bottom 0.152: R14.2 15.62,20.27 15.01,20.27 10.82,16.08 U$1.26
PAGE_A15  (via drill 0.35)
  Top 0.152: v16.31,24.31 19.36,27.36 19.36,52.81 38.25,71.7 53.42,71.7 54.25,70.87 54.25,69.49 55.47,68.28 56.24,68.28 57.76,69.8 58.37,69.8 IC3.21
  Bottom 0.152: U$1.27 10.82,14.33 14.25,17.75 15.62,17.75 R13.2 15.7,17.83 16.46,18.59 16.46,23.47 16.31,23.62 v16.31,24.31
PAGE_A16
  Bottom 0.152: R12.2 13.49,15.24 10.82,12.57 U$1.28 10.74,12.57 8.69,14.63 8.69,54.94 9.83,56.08 17.14,56.08 26.75,65.68 26.75,69.19 26.98,69.42 28.12,69.42 28.42,69.11 36.65,69.11 36.8,69.27 36.8,70.41 37.8,71.4 51.21,71.4 52.73,69.88 53.34,69.88 IC3.23
PAGE_A17
  Top 0.152: IC3.2 43.13,54.63 41.3,56.46 34.67,56.46 30.79,52.58 28.04,52.58 20.27,44.81 20.27,20.19 10.82,10.74 U$1.29
  Bottom 0.152: R11.2 15.62,12.65 12.72,12.65 10.82,10.74 U$1.29
PAGE_FN1  (via drill 0.35)
  Top 0.152: v22.48,49.76 22.48,55.02 28.88,61.42 36.73,61.42 45.11,69.8 45.72,69.8 IC3.26 | v18.36,16.54 10.82,8.99 U$1.30
  Bottom 0.152: R8.1 15.62,10.13 11.96,10.13 10.82,8.99 U$1.30 | v22.48,49.76 22.48,20.65 v18.36,16.54
PAGE_FN2  (via drill 0.35)
  Top 0.152: v18.44,14.86 10.82,7.24 U$1.31
  Bottom 0.152: R7.1 11.2,7.62 10.82,7.24 U$1.31 | v18.44,14.86 23.09,19.51 23.09,55.63 28.88,61.42 34.14,61.42 42.52,69.8 43.13,69.8 IC3.27
PAGE_FN3
  Top 0.152: IC3.1 40.62,54.56 39.09,54.56 35.28,50.75 26.67,50.75 20.57,44.65 20.57,15.16 10.82,5.41 U$1.32
  Bottom 0.152: R1.1 15.62,5.11 11.12,5.11 10.82,5.41 U$1.32
RAMCS  (via drill 0.35)
  Top 0.152: IC4.30 49.91,11.43 v52.73,14.25 | v61.65,30.4 61.65,50.83 64.85,54.03 64.85,55.85 65.46,56.46 71.25,56.46 72.01,55.7 72.01,53.57 71.48,53.03 70.1,53.03 70.07,53.07 | 70.07,53.07 68.58,54.56 IC3.12 | 70.07,53.07 69.57,52.58 69.57,49.07 75.13,43.51 80.39,43.51 81.69,42.22 92.43,42.22 93.34,43.13 95.25,43.13 EXT2.17
  Bottom 0.152: v52.73,14.25 52.96,14.25 54.33,15.62 56.84,15.62 64.47,23.24 65.84,23.24 66.37,23.77 66.37,27.05 65.15,28.27 63.78,28.27 v61.65,30.4
RD  (via drill 0.35)
  Top 0.152: U$1.63 28.96,57.91 28.88,57.91 28.19,57.23 v28.19,54.56 | v28.19,34.98 28.19,28.42 28.96,27.66 38.02,27.66 39.01,26.67 IC4.24 39.4,26.67 40.31,25.76 v46.48,25.76 | v56.54,26.67 IC2.24 | v56.69,58.9 57,58.6 79.55,58.6 82.22,55.93 95.25,55.93 EXT2.7
  Bottom 0.152: v28.19,34.98 v28.19,54.56 | v56.54,26.67 55.63,25.76 v46.48,25.76 | v56.69,58.9 29.95,58.9 U$1.63
RES  (via drill 0.35)
  Top 0.152: EXT.3 86.36,38.1 84.15,35.89 v71.78,35.89 | v38.94,38.18 33.22,38.18 31.24,40.16 25.53,40.16 v21.26,44.42 | v18.44,47.24 15.32,47.24 10.82,51.74 U$1.6 10.74,51.66 5.11,57.3 5.11,66.06 U$12.P$2
  Bottom 0.152: C3.1 5.11,63.25 5.11,66.06 U$12.P$2 | R6.1 15.62,52.05 11.12,52.05 10.82,51.74 U$1.6 | v71.78,35.89 67.67,35.89 65.38,38.18 v38.94,38.18 | v18.44,47.24 v21.26,44.42
ROMCS
  Top 0.152: IC3.13 69.57,56.16 65.61,56.16 65.15,55.7 65.15,53.87 62.87,51.59 62.87,34.21 64.77,32.31 IC2.22 64.77,31.7 72.24,31.7 73.61,30.33 81.99,30.33 82.83,29.49 95.71,29.49 96.7,30.48 EXT.10
RW  (via drill 0.35)
  Top 0.152: v41.76,51.51 49.61,51.51 v58.83,42.29 | v66.14,40.92 66.14,40.62 71.48,35.28 82.07,35.28 82.22,35.43 v92.89,35.43
  Bottom 0.152: U$1.61 38.02,55.24 v41.76,51.51 | v58.83,42.29 62.41,42.29 63.7,41 66.06,41 v66.14,40.92 | v92.89,35.43 93.65,35.43 94.79,36.58 95.71,36.58 96.47,35.81 96.47,34.37 97.77,33.07 EXT.8
STBY
  Bottom 0.152: R5.1 14.61,49.53 14.22,49.91 U$1.7
WR  (via drill 0.35)
  Top 0.152: v27.58,18.36 28.88,17.07 36.27,17.07 IC4.29 | v56.01,58.29 79.4,58.29 82.83,54.86 95.71,54.86 96.7,55.85 97.77,55.85 EXT2.8
  Bottom 0.152: v27.58,18.36 27.58,54.86 27.89,55.17 27.96,55.17 29.79,57 U$1.62 29.87,57 31.17,58.29 v56.01,58.29 | IC4.29 40.92,12.42 55.55,12.42 59.05,8.91 64.77,8.91 IC2.31

### Text on the board
Top: LILITH-601 / CPU-MEM v1.3 / z.lilith.am
tPlace: POWER | RESET | GND | GND | ADDR / DECODER | DECDIS | EXTAL | HALT | BA | RD | WR | GND | A9 | A8 | P20 | A11 | A10 | P21 | A13 | A12 | P22 | A15 | A14 | P23RX | RAMCS | A16 | P24TX | GND | GND | P25 | RES | NMI | P26 | IRQ1 | IRQ2 | P27 | E | RW | P52 | EXTCS | ROMCS | P53 | D1 | D0 | P54 | D3 | D2 | P55 | D5 | D4 | P56 | D7 | D6 | P57 | A1 | A0 | +5V | A3 | A2 | A5 | A4 | A7 | A6 | CPU | RAM | ROM | +5V | +5V